# EAGLE design nixie - final1 (EAGLE 9.4.0)
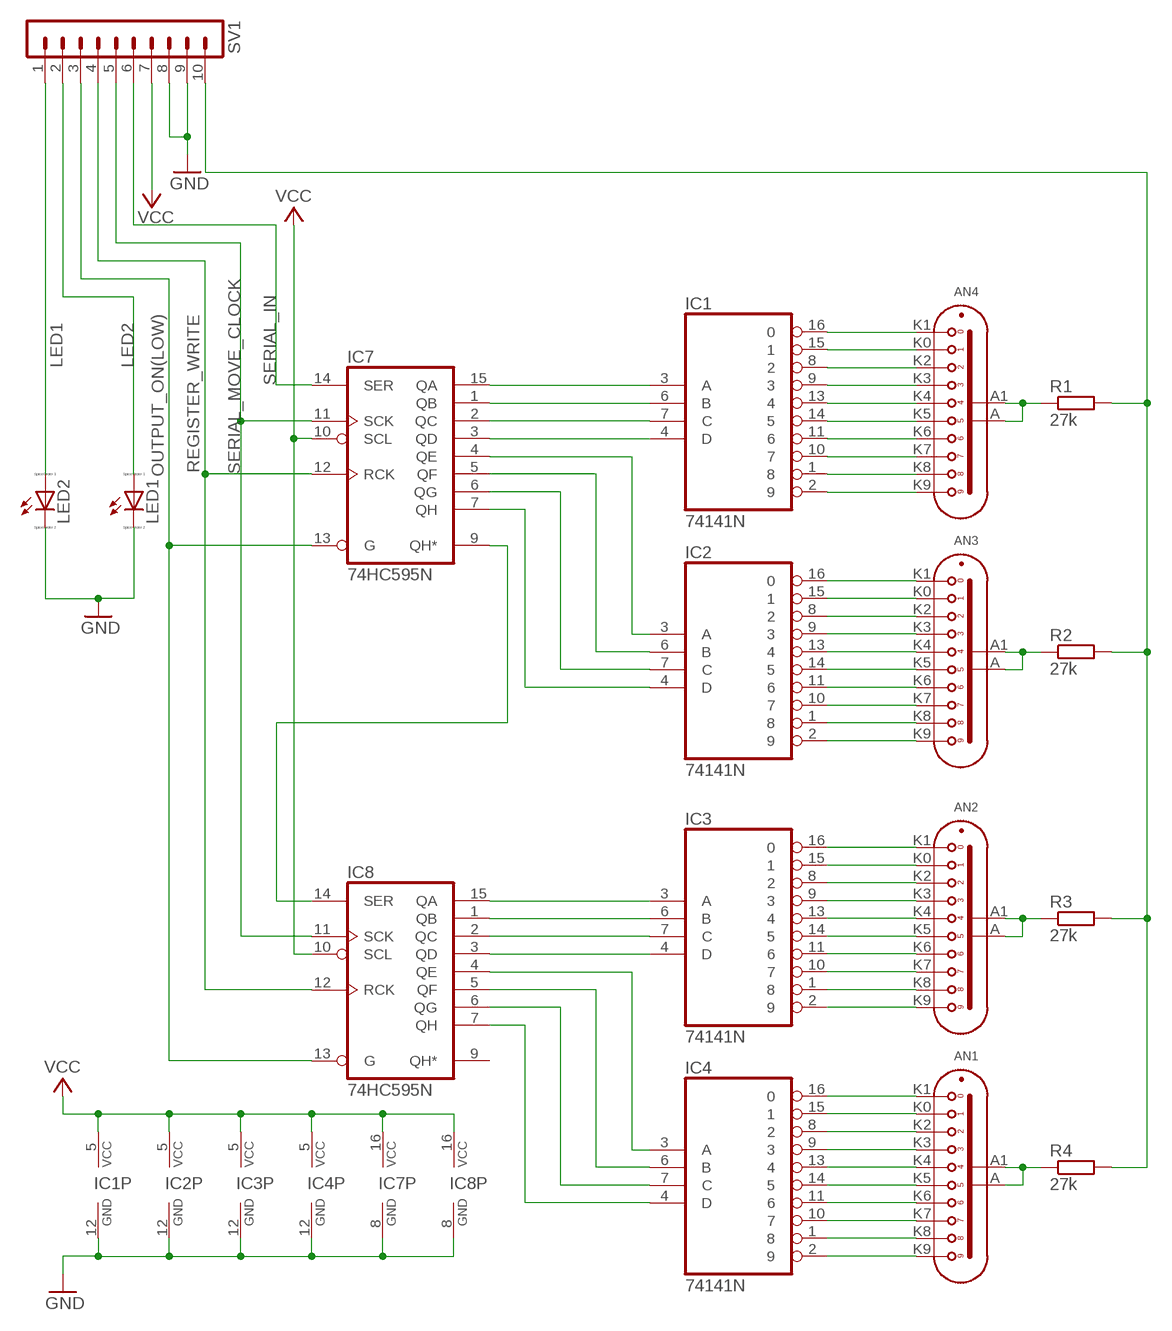
[diagram p0: schematic, sheet 1]

## Parts
AN1  ZM1042-SOCKET_ELRADO  [ZM1040.SOCKET]
AN2  ZM1042-SOCKET_ELRADO  [ZM1040.SOCKET]
AN3  ZM1042-SOCKET_ELRADO  [ZM1040.SOCKET]
AN4  ZM1042-SOCKET_ELRADO  [ZM1040.SOCKET]
IC1  74141N  [DIL16]
IC2  74141N  [DIL16]
IC3  74141N  [DIL16]
IC4  74141N  [DIL16]
IC7  74HC595N  [DIL16]
IC8  74HC595N  [DIL16]
LED1  LED_ELD260  [LED_LD260]
LED2  LED_ELD260  [LED_LD260]
R1  27k  R-EU_0309/12  [0309/12]
R2  27k  R-EU_0309/12  [0309/12]
R3  27k  R-EU_0309/12  [0309/12]
R4  27k  R-EU_0309/12  [0309/12]
SV1  MA10-1  [MA10-1]

## Nets
GND: IC1.12(GND) IC2.12(GND) IC3.12(GND) IC4.12(GND) IC7.8(GND) IC8.8(GND) LED1.K(C) LED2.K(C) SV1.8 SV1.9
LED1: LED2.A SV1.1
LED2: LED1.A SV1.2
N$1: AN4.K1 IC1.16
N$2: AN4.K0 IC1.15
N$3: AN4.K2 IC1.8
N$4: AN4.K3 IC1.9
N$5: AN4.K4 IC1.13
N$6: AN4.K5 IC1.14
N$7: AN4.K6 IC1.11
N$8: AN4.K7 IC1.10
N$9: AN4.K8 IC1.1
N$10: AN4.K9 IC1.2
N$11: AN1.K0 IC4.15
N$12: AN1.K2 IC4.8
N$13: AN1.K4 IC4.13
N$14: AN1.K3 IC4.9
N$15: AN1.K5 IC4.14
N$16: AN1.K6 IC4.11
N$17: AN1.K7 IC4.10
N$18: AN1.K8 IC4.1
N$19: AN1.K9 IC4.2
N$20: AN1.K1 IC4.16
N$21: AN2.K0 IC3.15
N$22: AN2.K2 IC3.8
N$23: AN2.K4 IC3.13
N$24: AN2.K3 IC3.9
N$25: AN2.K5 IC3.14
N$26: AN2.K6 IC3.11
N$27: AN2.K7 IC3.10
N$28: AN2.K8 IC3.1
N$29: AN2.K9 IC3.2
N$30: AN2.K1 IC3.16
N$31: AN3.K0 IC2.15
N$32: AN3.K2 IC2.8
N$33: AN3.K4 IC2.13
N$34: AN3.K3 IC2.9
N$35: AN3.K5 IC2.14
N$36: AN3.K6 IC2.11
N$37: AN3.K7 IC2.10
N$38: AN3.K8 IC2.1
N$39: AN3.K9 IC2.2
N$40: AN3.K1 IC2.16
N$41: R1.2 R2.2 R3.2 R4.2 SV1.10
N$61: IC1.3(A) IC7.15(QA)
N$62: IC1.6(B) IC7.1(QB)
N$63: IC1.7(C) IC7.2(QC)
N$64: IC1.4(D) IC7.3(QD)
N$65: IC2.3(A) IC7.4(QE)
N$66: IC2.6(B) IC7.5(QF)
N$67: IC2.7(C) IC7.6(QG)
N$68: IC2.4(D) IC7.7(QH)
N$69: IC3.3(A) IC8.15(QA)
N$70: IC3.6(B) IC8.1(QB)
N$71: IC3.7(C) IC8.2(QC)
N$72: IC3.4(D) IC8.3(QD)
N$73: IC4.3(A) IC8.4(QE)
N$74: IC4.6(B) IC8.5(QF)
N$75: IC4.7(C) IC8.6(QG)
N$76: IC4.4(D) IC8.7(QH)
N$85: IC7.9(QH*) IC8.14(SER)
N$89: AN4.A1(A2) AN4.A(A1) R1.1
N$90: AN3.A1(A2) AN3.A(A1) R2.1
N$91: AN2.A1(A2) AN2.A(A1) R3.1
N$92: AN1.A1(A2) AN1.A(A1) R4.1
OUTPUT_ON(LOW): IC7.13(G) IC8.13(G) SV1.3
REGISTER_WRITE: IC7.12(RCK) IC8.12(RCK) SV1.4
SERIAL_IN: IC7.14(SER) SV1.6
SERIAL_MOVE_CLOCK: IC7.11(SCK) IC8.11(SCK) SV1.5
VCC: IC1.5(VCC) IC2.5(VCC) IC3.5(VCC) IC4.5(VCC) IC7.10(SCL) IC7.16(VCC) IC8.10(SCL) IC8.16(VCC) SV1.7
Unconnected: IC8.9(QH*)

## Library data of the parts
AN1-AN4 = nixie_tube:ZM1042: Indicator Tube (numeral height 30mm, no filter, side view, long-life typ)
IC1-IC4 = 74xx-eu:74*141: BCD to decimal DECODER/DRIVER
IC7 IC8 = 74xx-eu:74*595: 8-bit SHIFT REGISTER, output latch
LED1 LED2 = eagle-ltspice:LED_E: LED Source: http://www.osram.convergy.de Source: www.luxeon.com Source: www.kingbright.com; SPICEMODEL: NONE; SPICEPREFIX: D; SPICETYPE: diode
R1-R4 = resistor:R-EU_: RESISTOR, European symbol
SV1 = con-lstb:MA10-1: PIN HEADER; OC_FARNELL: unknown; OC_NEWARK: unknown

## Board
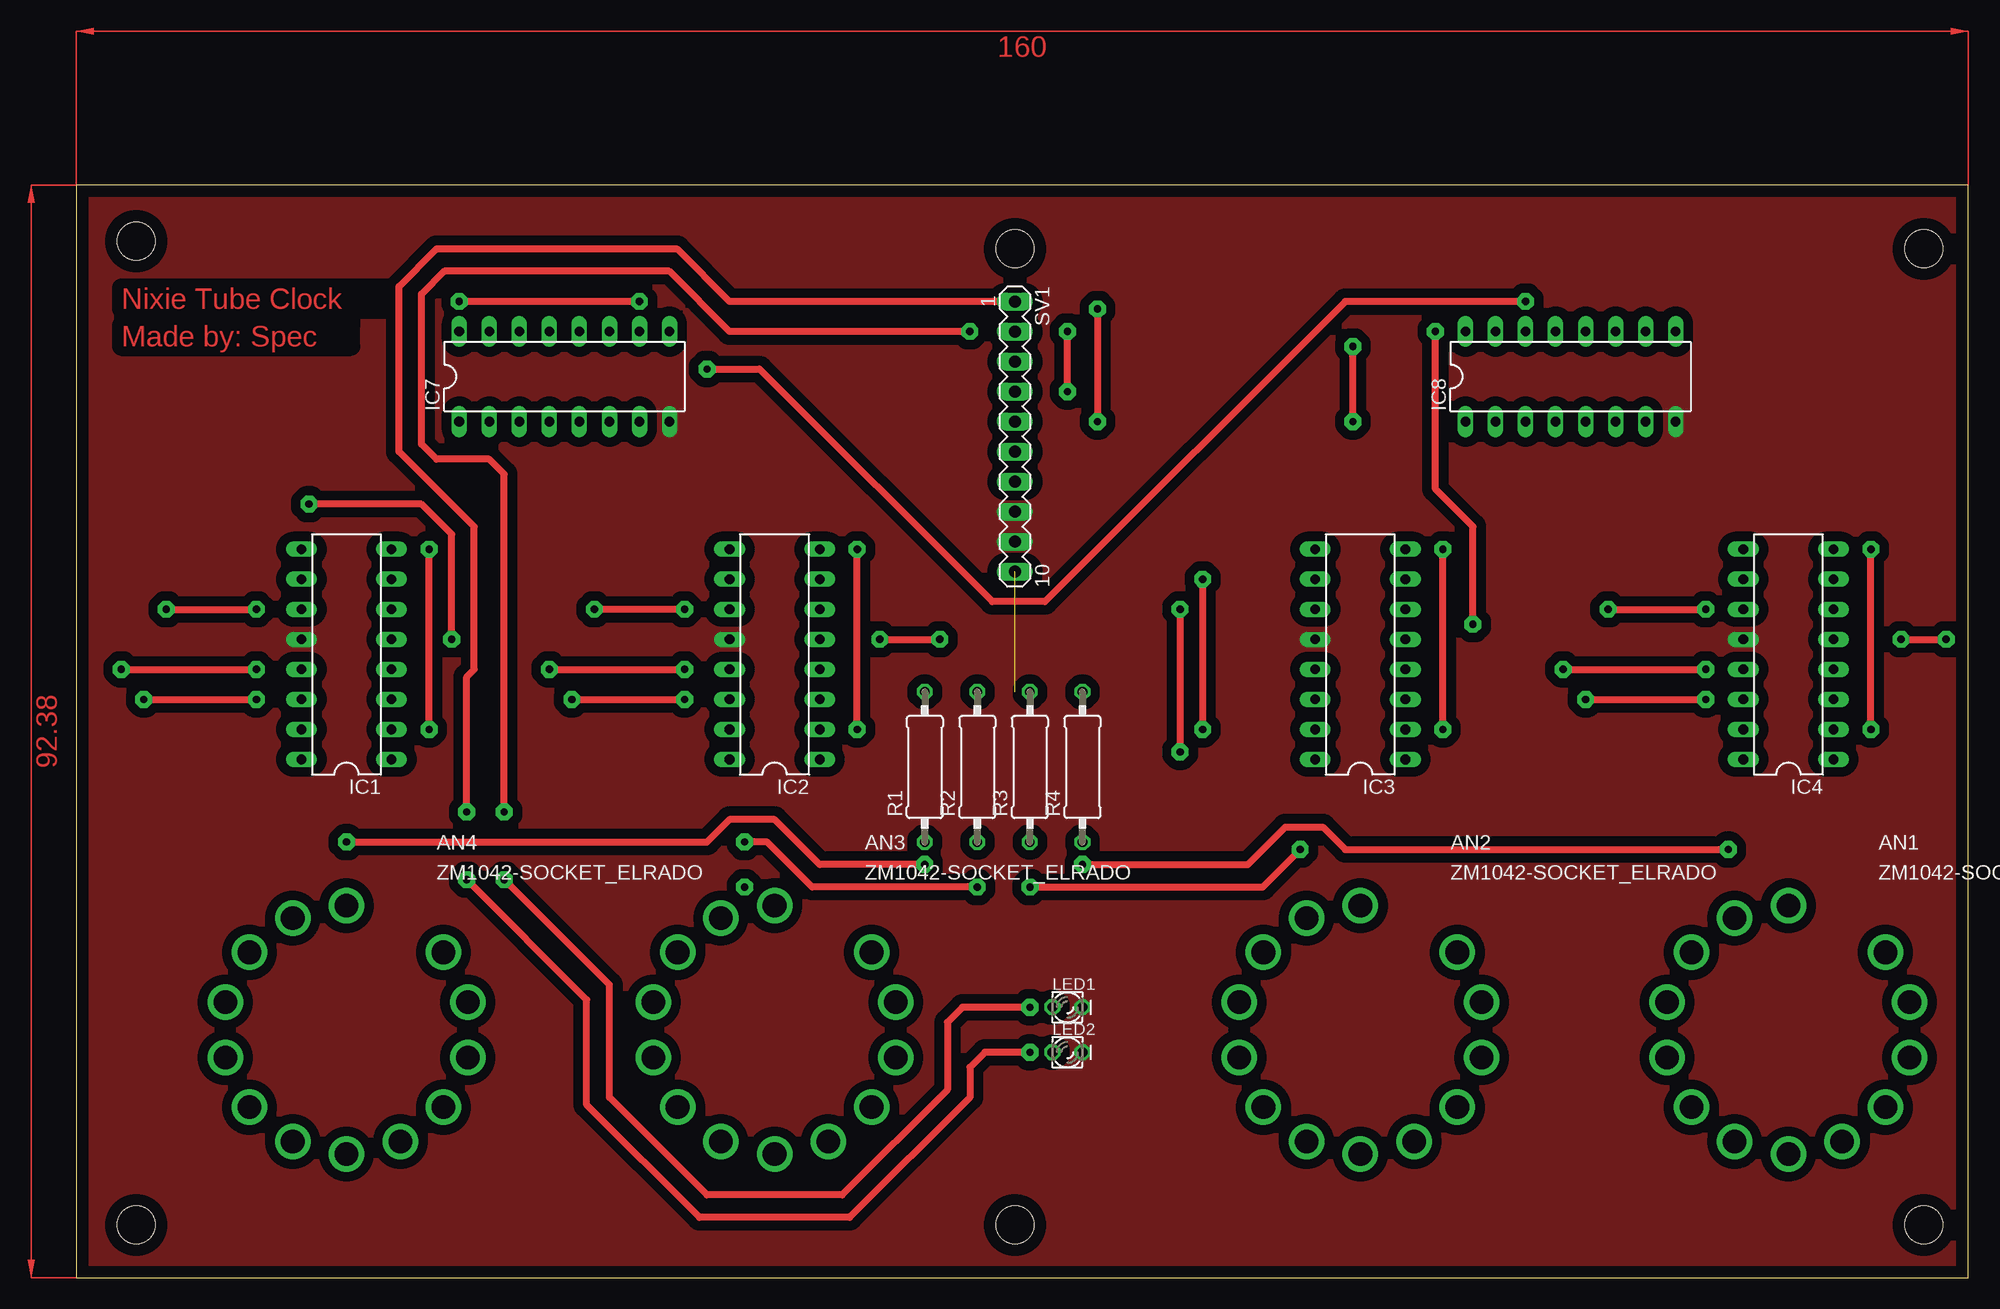
[diagram p1: board, top side]
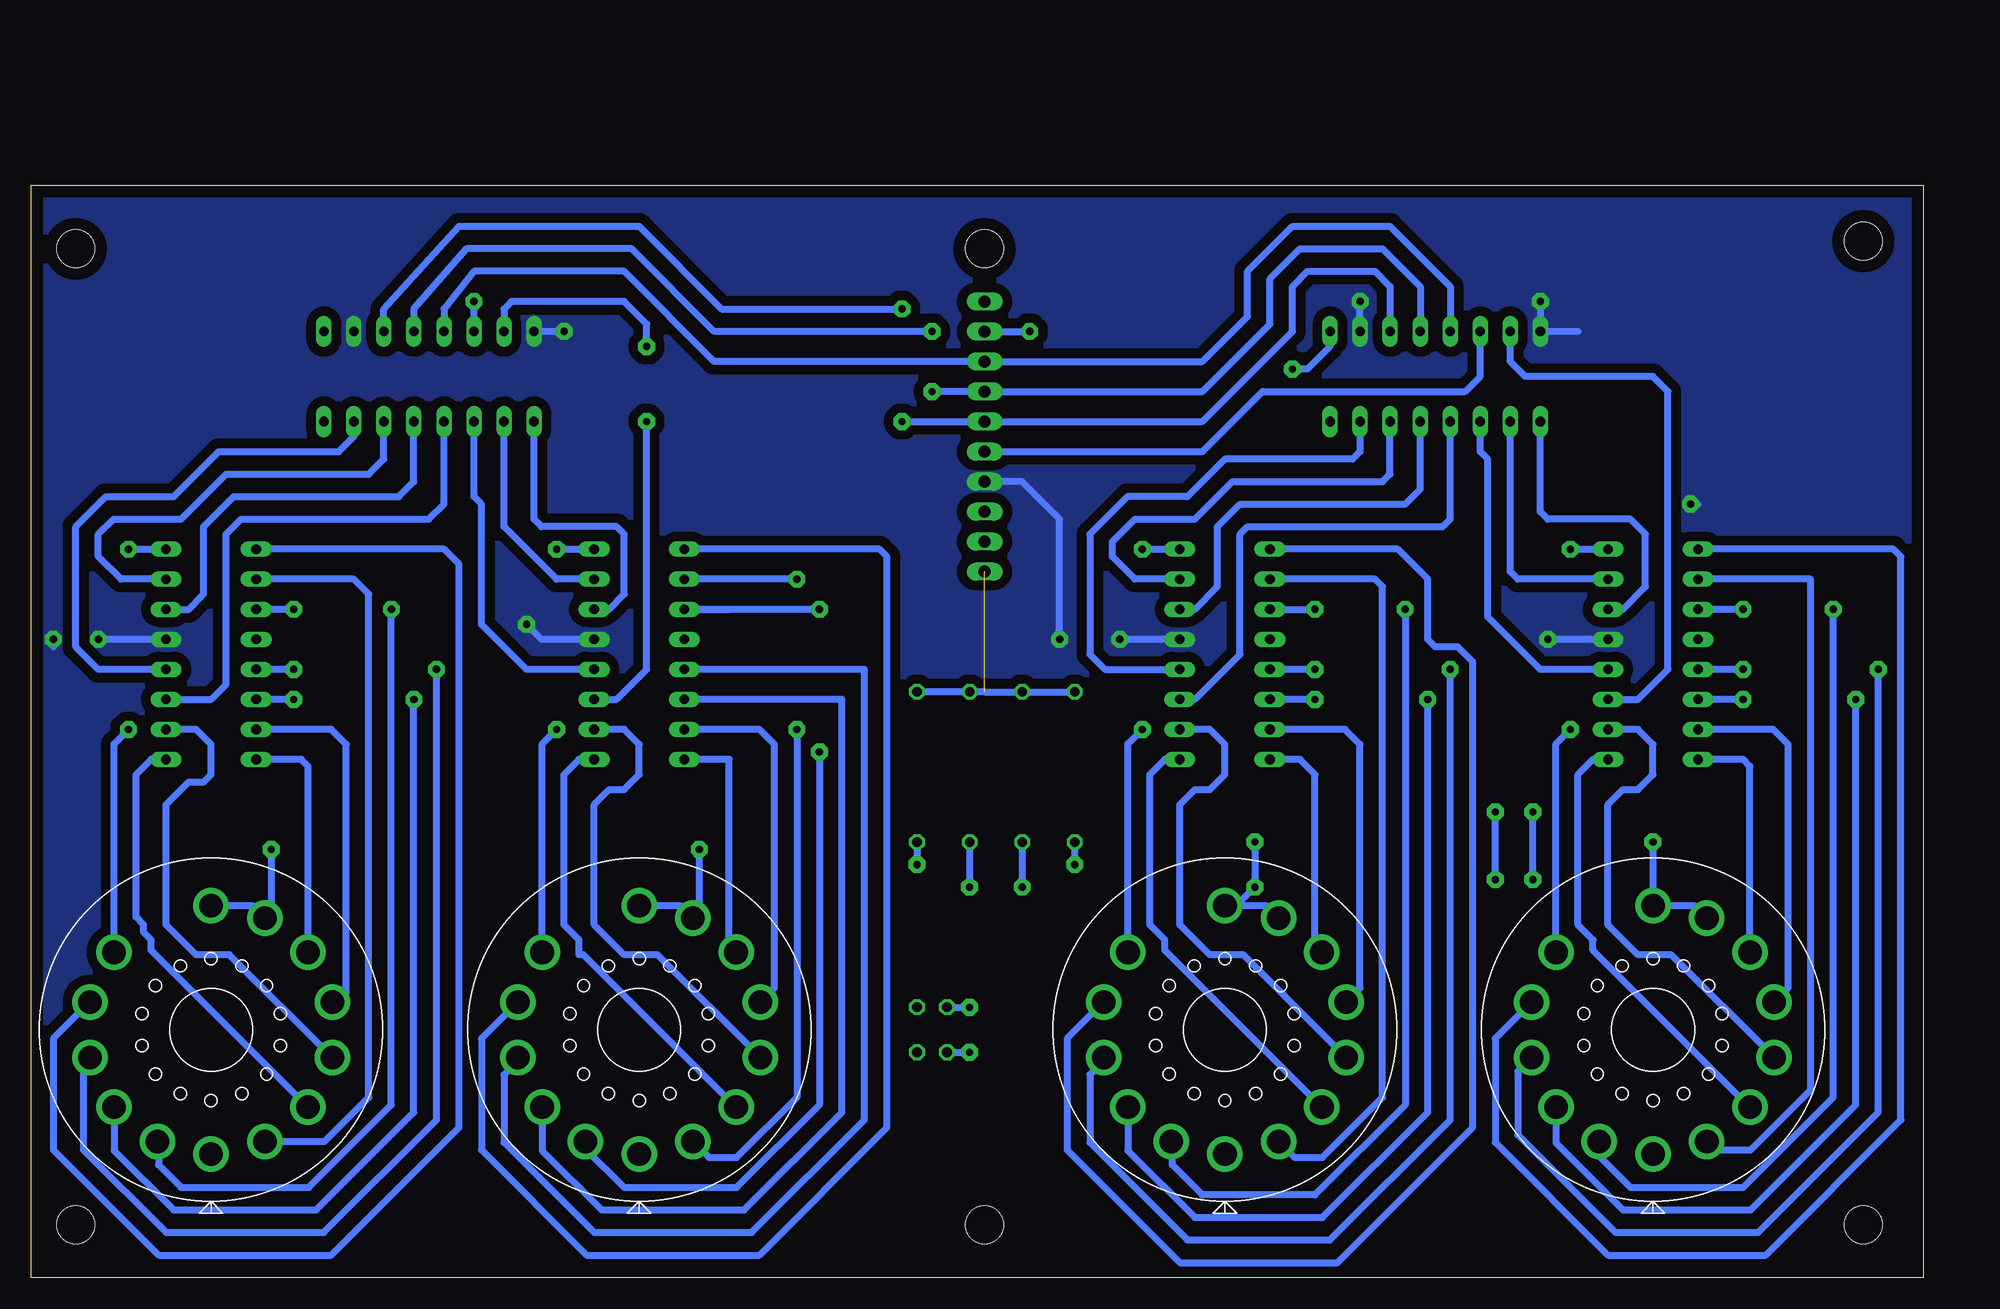
[diagram p2: board, bottom side, seen from below]

Size 160 x 92.38 mm. Coordinates in mm from the lower left corner, seen from the top.
Outline: 0,0 160,0 160,92.38 0,92.38 0,0
Copper layers (1*16): Top 0.035mm / dielectric 1.5mm / Bottom 0.035mm
Design rules "default *": minimum track width 10mil, minimum drill 24mil, track to track 32mil, track to pad 32mil, pad to pad 32mil, via to via 32mil, smd to smd 8mil, copper to edge 40mil, drill to drill 8mil, minimum pad ring 10mil, minimum via ring 8mil, stop-mask expansion 4mil, vias tented up to drill 0mil, thermal gap 10mil
Holes 3.2 mm at 5.08,4.45 5.08,87.63 79.38,4.45 79.38,87 156.21,4.45 156.21,87

### Footprints (pad centres in the part's own frame; a part is rotated, then mirrored left to right if it is on the bottom)
ZM1040.SOCKET = drill 2: A 0,10.5; A1 -4.55,9.45; IC 0,-10.5; K0 -10.25,2.35; K1 -8.2,6.55; K2 8.2,6.55; K3 10.25,2.35; K4 10.25,-2.35; K5 8.2,-6.55; K6 4.55,-9.45; K7 -4.55,-9.45; K8 -8.2,-6.55; K9 -10.25,-2.35
DIL16 = drill 0.813 long: 1 -8.89,-3.81; 2 -6.35,-3.81; 3 -3.81,-3.81; 4 -1.27,-3.81; 5 1.27,-3.81; 6 3.81,-3.81; 7 6.35,-3.81; 8 8.89,-3.81; 9 8.89,3.81; 10 6.35,3.81; 11 3.81,3.81; 12 1.27,3.81; 13 -1.27,3.81; 14 -3.81,3.81; 15 -6.35,3.81; 16 -8.89,3.81
LED_LD260 = drill 0.813 octagon: A -1.27,0; K 1.27,0
0309/12 = drill 0.813 octagon: 1 -6.35,0; 2 6.35,0
MA10-1 = drill 1.016 long: 1 -11.43,0; 2 -8.89,0; 3 -6.35,0; 4 -3.81,0; 5 -1.27,0; 6 1.27,0; 7 3.81,0; 8 6.35,0; 9 8.89,0; 10 11.43,0

### Placement (x,y rotation side)
AN1  144.78,20.95 0 top
AN2  108.58,20.95 0 top
AN3  59.05,20.95 0 top
AN4  22.86,20.95 0 top
IC1  22.86,52.7 90 top
IC2  59.05,52.7 90 top
IC3  108.58,52.7 90 top
IC4  144.78,52.7 90 top
IC7  41.27,76.2 0 top
IC8  126.36,76.2 0 top
LED1  83.82,22.86 0 top
LED2  83.82,19.05 0 top
R1  71.75,43.18 90 top
R2  76.2,43.18 90 top
R3  80.64,43.18 90 top
R4  85.09,43.18 90 top
SV1  79.38,71.12 270 top

### Tracks (layer width: path | path; a pad name or v marks a point on that pad's centre or on a via)
GND
  pour Top (no thermals): 0,93.34 160.02,93.34 160.02,0 0,0
LED1  (via drill 0.61 pad 1.42)
  Top 0.61: v80.64,19.05 76.83,19.05 75.56,17.78 75.56,15.24 65.41,5.08 52.7,5.08 43.18,14.61 43.18,23.5 v33.02,33.66 | v33.02,39.37 33.02,50.8 33.66,51.44 33.66,63.5 27.3,69.85 27.3,83.82 30.48,87 50.8,87 55.24,82.55 SV1.1
  Bottom 0.61: LED2.A v80.64,19.05 | v33.02,33.66 v33.02,39.37
LED2  (via drill 0.61 pad 1.42)
  Top 0.61: v75.56,80.01 55.24,80.01 50.16,85.09 31.11,85.09 29.21,83.19 29.21,70.48 30.48,69.22 34.92,69.22 36.2,67.94 v36.2,39.37 | v80.64,22.86 74.93,22.86 73.66,21.59 73.66,15.88 64.77,6.99 53.34,6.99 45.09,15.24 45.09,24.77 v36.2,33.66
  Bottom 0.61: SV1.2 v75.56,80.01 | LED1.A v80.64,22.86 | v36.2,33.66 v36.2,39.37
N$1
  Bottom 0.61: AN4.K1 14.66,43.23 15.24,43.81 IC1.16
N$2
  Bottom 0.61: AN4.K0 11.43,24.48 11.43,45.09 12.7,46.35 IC1.15
N$3  (via drill 0.61 pad 1.42)
  Top 0.61: v29.84,46.35 v29.84,61.59
  Bottom 0.61: AN4.K2 31.06,45.14 v29.84,46.35 | v29.84,61.59 IC1.8
N$4
  Bottom 0.61: AN4.K3 36.2,20.22 36.2,11.43 26.67,1.91 13.34,1.91 1.91,13.34 1.91,60.96 2.54,61.59 IC1.9
N$5  (via drill 0.61 pad 1.42)
  Top 0.61: v3.81,51.44 v15.24,51.44
  Bottom 0.61: AN4.K4 34.29,17.43 34.29,12.06 26.04,3.81 13.97,3.81 3.81,13.97 v3.81,51.44 | v15.24,51.44 IC1.13
N$6  (via drill 0.61 pad 1.42)
  Top 0.61: v5.71,48.9 v15.24,48.9
  Bottom 0.61: AN4.K5 31.06,11.38 25.4,5.71 14.61,5.71 5.71,14.61 v5.71,48.9 | v15.24,48.9 IC1.14
N$7  (via drill 0.61 pad 1.42)
  Top 0.61: v7.62,56.52 v15.24,56.52
  Bottom 0.61: AN4.K6 27.41,10.27 24.77,7.62 15.24,7.62 7.62,15.24 v7.62,56.52 | v15.24,56.52 IC1.11
N$8
  Bottom 0.61: AN4.K7 17.86,11.51 17.14,10.79 14.61,10.79 9.53,15.88 9.53,59.05 IC1.10
N$9
  Bottom 0.61: AN4.K8 27.94,27.68 27.94,28.57 29.21,29.84 29.21,42.55 27.94,43.81 IC1.1
N$10
  Bottom 0.61: AN4.K9 21.31,27.3 24.13,27.3 26.67,29.84 26.67,40.01 25.4,41.27 24.13,41.27 22.86,42.55 22.86,45.09 24.13,46.35 IC1.2
N$11
  Bottom 0.61: AN1.K0 134.18,23.3 133.35,24.13 133.35,45.09 134.62,46.35 IC4.15
N$12  (via drill 0.61 pad 1.42)
  Top 0.61: v151.76,46.35 v151.76,61.59
  Bottom 0.61: AN1.K2 152.98,45.14 v151.76,46.35 | v151.76,61.59 IC4.8
N$13  (via drill 0.61 pad 1.42)
  Top 0.61: v125.73,51.44 v137.79,51.44
  Bottom 0.61: AN1.K4 155.57,18.06 155.57,10.79 148.59,3.81 135.25,3.81 125.73,13.34 v125.73,51.44 | v137.79,51.44 IC4.13
N$14
  Bottom 0.61: AN1.K3 158.12,20.22 158.12,10.79 149.22,1.91 134.62,1.91 123.83,12.7 123.83,60.33 125.09,61.59 IC4.9
N$15  (via drill 0.61 pad 1.42)
  Top 0.61: v127.64,48.9 v137.79,48.9
  Bottom 0.61: AN1.K5 152.98,10.74 147.96,5.71 135.89,5.71 127.64,13.97 v127.64,48.9 | v137.79,48.9 IC4.14
N$16  (via drill 0.61 pad 1.42)
  Top 0.61: v129.54,56.52 v137.79,56.52
  Bottom 0.61: AN1.K6 149.22,11.4 149.22,9.53 147.32,7.62 136.53,7.62 129.54,14.61 v129.54,56.52 | v137.79,56.52 IC4.11
N$17
  Bottom 0.61: AN1.K7 135.18,11.51 131.44,15.24 131.44,57.78 132.72,59.05 IC4.10
N$18
  Bottom 0.61: AN1.K8 149.86,27.68 149.86,28.57 150.5,29.21 150.5,29.84 151.13,30.48 151.13,42.55 149.86,43.81 IC4.1
N$19
  Bottom 0.61: AN1.K9 143.23,27.3 146.05,27.3 148.59,29.84 148.59,40.01 146.69,41.91 145.41,41.91 144.78,42.55 144.78,45.09 146.05,46.35 IC4.2
N$20
  Bottom 0.61: AN1.K1 136.58,43.23 137.16,43.81 IC4.16
N$21
  Bottom 0.61: AN2.K0 97.16,24.48 97.16,45.09 98.42,46.35 IC3.15
N$22  (via drill 0.61 pad 1.42)
  Top 0.61: v115.57,46.35 v115.57,61.59
  Bottom 0.61: AN2.K2 116.78,45.14 v115.57,46.35 | v115.57,61.59 IC3.8
N$23
  Bottom 0.61: AN2.K4 118.83,18.32 120.02,17.14 120.02,11.43 112.39,3.81 99.06,3.81 89.53,13.34 89.53,51.44 IC3.13
N$24
  Bottom 0.61: AN2.K3 121.92,20.22 121.92,10.79 113.03,1.91 98.42,1.91 87.63,12.7 87.63,60.96 88.27,61.59 IC3.9
N$25
  Bottom 0.61: AN2.K5 116.78,10.74 111.76,5.71 99.69,5.71 91.44,13.97 91.44,48.9 IC3.14 100.97,48.9
N$26  (via drill 0.61 pad 1.42)
  Top 0.61: v93.34,56.52 v93.34,44.45
  Bottom 0.61: AN2.K6 113.14,10.9 109.86,7.62 100.33,7.62 93.34,14.61 v93.34,44.45 | v93.34,56.52 IC3.11 | 101.6,56.52 IC3.11 | IC3.11 100.97,56.52
N$27  (via drill 0.61 pad 1.42)
  Top 0.61: v95.25,59.05 v95.25,46.35
  Bottom 0.61: AN2.K7 102.69,10.16 100.33,10.16 95.25,15.24 v95.25,46.35 | v95.25,59.05 IC3.10
N$28
  Bottom 0.61: AN2.K8 113.28,27.3 113.67,27.3 113.67,28.57 114.94,29.84 114.94,42.55 113.67,43.81 IC3.1
N$29
  Bottom 0.61: AN2.K9 107.03,27.3 109.86,27.3 112.39,29.84 112.39,40.01 111.12,41.27 109.86,41.27 108.58,42.55 108.58,45.09 109.86,46.35 IC3.2
N$30
  Bottom 0.61: AN2.K1 100.97,28.09 100.97,43.81 IC3.16
N$31
  Bottom 0.61: AN3.K0 47.62,24.48 47.62,45.09 48.9,46.35 IC2.15
N$32  (via drill 0.61 pad 1.42)
  Top 0.61: v66.04,46.35 v66.04,61.59
  Bottom 0.61: AN3.K2 67.25,45.14 v66.04,46.35 | v66.04,61.59 IC2.8
N$33  (via drill 0.61 pad 1.42)
  Top 0.61: v40.01,51.44 v51.44,51.44
  Bottom 0.61: AN3.K4 69.31,18.32 70.48,17.14 70.48,11.43 62.23,3.17 50.16,3.17 40.01,13.34 v40.01,51.44 | v51.44,51.44 IC2.13
N$34
  Bottom 0.61: AN3.K3 72.39,20.22 72.39,10.79 62.87,1.27 49.53,1.27 38.1,12.7 38.1,52.07 39.37,53.34 41.27,53.34 41.91,53.98 41.91,59.05 44.45,61.59 IC2.9
N$35  (via drill 0.61 pad 1.42)
  Top 0.61: v41.91,48.9 v51.44,48.9
  Bottom 0.61: AN3.K5 67.25,10.74 61.59,5.08 50.8,5.08 41.91,13.97 v41.91,48.9 | v51.44,48.9 IC2.14
N$36  (via drill 0.61 pad 1.42)
  Top 0.61: v51.44,56.52 v43.81,56.52
  Bottom 0.61: IC2.11 v51.44,56.52 | v43.81,56.52 43.81,14.61 51.44,6.99 60.96,6.99 63.5,9.53 63.5,11.4 AN3.K6
N$37
  Bottom 0.61: AN3.K7 53.16,10.16 50.8,10.16 45.72,15.24 45.72,58.42 46.35,59.05 IC2.10
N$38
  Bottom 0.61: AN3.K8 64.14,27.68 64.14,28.57 65.41,29.84 65.41,42.55 64.14,43.81 IC2.1
N$39
  Bottom 0.61: AN3.K9 57.51,27.3 60.33,27.3 62.87,29.84 62.87,40.01 61.59,41.27 60.33,41.27 59.05,42.55 59.05,45.09 60.33,46.35 IC2.2
N$40
  Bottom 0.61: AN3.K1 51.44,28.09 51.44,42.55 52.7,43.81 IC2.16
N$41  (1 unrouted)
  Bottom 0.61: R1.2 R2.2 79.38,49.53 R3.2 R4.2
N$61
  Bottom 0.61: IC1.3 24.13,48.9 21.59,51.44 21.59,74.93 22.86,76.2 33.66,76.2 34.92,77.47 IC7.15
N$62
  Bottom 0.61: IC1.6 25.4,56.52 23.5,58.42 23.5,62.87 24.77,64.14 31.75,64.14 32.38,64.77 IC7.1
N$63
  Bottom 0.61: IC1.7 34.29,59.05 34.92,59.69 IC7.2
N$64
  Bottom 0.61: IC1.4 32.38,51.44 36.83,55.88 36.83,69.22 37.47,69.85 IC7.3
N$65
  Bottom 0.61: IC2.3 61.59,48.9 57.78,52.7 57.78,62.87 57.15,63.5 40.64,63.5 40.01,64.14 IC7.4
N$66
  Bottom 0.61: IC2.6 61.59,56.52 59.69,58.42 59.69,63.5 57.78,65.41 43.81,65.41 42.55,66.67 IC7.5
N$67
  Bottom 0.61: IC2.7 66.67,59.05 68.58,60.96 68.58,62.23 66.67,64.14 61.59,64.14 58.42,67.31 45.72,67.31 45.09,67.94 IC7.6
N$68
  Bottom 0.61: IC7.7 47.62,69.85 48.26,69.22 59.05,69.22 62.23,66.04 67.31,66.04 70.48,62.87 70.48,52.7 69.22,51.44 IC2.4
N$69  (via drill 0.61 pad 1.42)
  Top 0.61: v107.95,72.39 v107.95,78.74
  Bottom 0.61: IC3.3 110.49,48.9 107.95,51.44 v107.95,72.39 | v107.95,78.74 107.95,80.64 109.86,82.55 119.38,82.55 120.02,81.92 IC8.15
N$70
  Bottom 0.61: IC3.6 111.12,56.52 109.86,57.78 109.86,62.87 110.49,63.5 116.84,63.5 117.47,64.14 IC8.1
N$71
  Bottom 0.61: IC3.7 115.57,59.05 120.02,63.5 IC8.2
N$72
  Bottom 0.61: IC3.4 118.11,51.44 121.92,55.24 121.92,65.41 122.56,66.04 IC8.3
N$73
  Bottom 0.61: IC4.3 144.78,48.9 143.51,50.16 143.51,62.87 142.24,64.14 126.36,64.14 125.09,65.41 IC8.4
N$74
  Bottom 0.61: IC4.6 146.69,56.52 145.41,57.78 145.41,63.5 142.88,66.04 128.91,66.04 127.64,67.31 IC8.5
N$75
  Bottom 0.61: IC4.7 152.4,59.05 154.31,60.96 154.31,62.87 153.03,64.14 147.32,64.14 143.51,67.94 131.44,67.94 130.18,69.22 IC8.6
N$76
  Bottom 0.61: IC4.4 154.31,51.44 156.21,53.34 156.21,63.5 153.67,66.04 147.96,66.04 144.15,69.85 133.99,69.85 132.72,71.12 IC8.7
N$85  (via drill 0.61 pad 1.42)
  Top 0.61: v122.56,82.55 107.31,82.55 81.92,57.15 77.47,57.15 57.78,76.83 v53.34,76.83
  Bottom 0.61: IC8.14 v122.56,82.55 | IC7.9 50.16,78.74 52.07,76.83 v53.34,76.83
N$89  (via drill 0.61 pad 1.42)
  Top 0.61: v71.75,34.92 62.87,34.92 59.05,38.73 55.24,38.73 53.34,36.83 v22.86,36.83
  Bottom 0.61: R1.1 v71.75,34.92 | v22.86,36.83 AN4.A 19.39,31.45 17.78,29.84 17.78,29.88 AN4.A1
N$90  (via drill 0.61 pad 1.42)
  Top 0.61: v76.2,33.02 62.23,33.02 58.42,36.83 v56.52,36.83
  Bottom 0.61: AN3.A1 55.55,31.45 AN3.A 58.08,31.45 v56.52,33.02 v56.52,36.83 | R2.1 v76.2,33.02
N$91  (via drill 0.61 pad 1.42)
  Top 0.61: v80.64,33.02 100.33,33.02 v103.5,36.2
  Bottom 0.61: R3.1 v80.64,33.02 | v103.5,36.2 103.5,30.93 AN2.A1 105.08,31.45 AN2.A
N$92  (via drill 0.61 pad 1.42)
  Top 0.61: v85.09,34.92 99.06,34.92 102.23,38.1 105.41,38.1 107.31,36.2 v139.7,36.2
  Bottom 0.61: R4.1 v85.09,34.92 | v139.7,36.2 139.7,30.93 AN1.A1 141.28,31.45 AN1.A
OUTPUT_ON(LOW)
  Bottom 0.61: IC7.13 40.01,83.82 45.09,88.9 53.34,88.9 57.15,85.09 57.15,81.28 60.96,77.47 SV1.3 102.23,77.47 109.86,85.09 122.56,85.09 125.09,81.92 IC8.13
REGISTER_WRITE  (via drill 0.61 pad 1.42)
  Top 0.61: v83.82,74.93 v83.82,80.01
  Bottom 0.61: IC7.12 42.55,83.82 45.72,87 52.7,87 55.24,84.45 55.24,80.64 60.96,74.93 SV1.4 v83.82,74.93 | v83.82,80.01 102.23,80.01 109.22,87 123.19,87 127.64,81.92 IC8.12
SERIAL_IN
  Bottom 0.61: SV1.6 60.96,69.85 55.88,74.93 38.73,74.93 37.47,76.2 IC7.14
SERIAL_MOVE_CLOCK  (via drill 0.61 pad 1.42)
  Top 0.61: v86.36,81.92 v86.36,72.39
  Bottom 0.61: IC7.11 45.09,83.82 46.35,85.09 52.07,85.09 53.34,83.82 53.34,80.01 60.96,72.39 SV1.5 v86.36,72.39 | IC8.11 130.18,81.92 123.83,88.9 108.58,88.9 101.6,81.92 v86.36,81.92
VCC  (via drill 0.61 pad 1.42)
  Top 0.61: v67.94,53.98 v73.03,53.98 | v31.75,53.98 31.75,62.87 29.21,65.41 v19.68,65.41 | v118.11,55.24 118.11,63.5 114.94,66.67 v114.94,80.01 | v47.62,82.55 v32.38,82.55 | v154.31,53.98 v158.12,53.98
  Bottom 0.61: IC2.5 v67.94,53.98 | v73.03,53.98 73.03,64.14 76.2,67.31 SV1.7 | IC1.5 v31.75,53.98 | 29.21,80.01 IC7.16 v32.38,82.55 | IC3.5 116.84,53.98 v118.11,55.24 | v114.94,80.01 IC8.16 | IC7.10 v47.62,82.55 | IC4.5 v154.31,53.98 | v158.12,53.98 158.12,53.34 | v19.68,65.41 19.05,65.41
  pour Bottom (no thermals): 160.02,0 0,0 0,93.34 160.02,93.34
(copper drawn outside any net)
  shapes: Top area x2

### Text on the board
Top: Nixie Tube Clock | Made by: Spec